# Altium schematic sheet 继电器版本.SchDoc
size A4
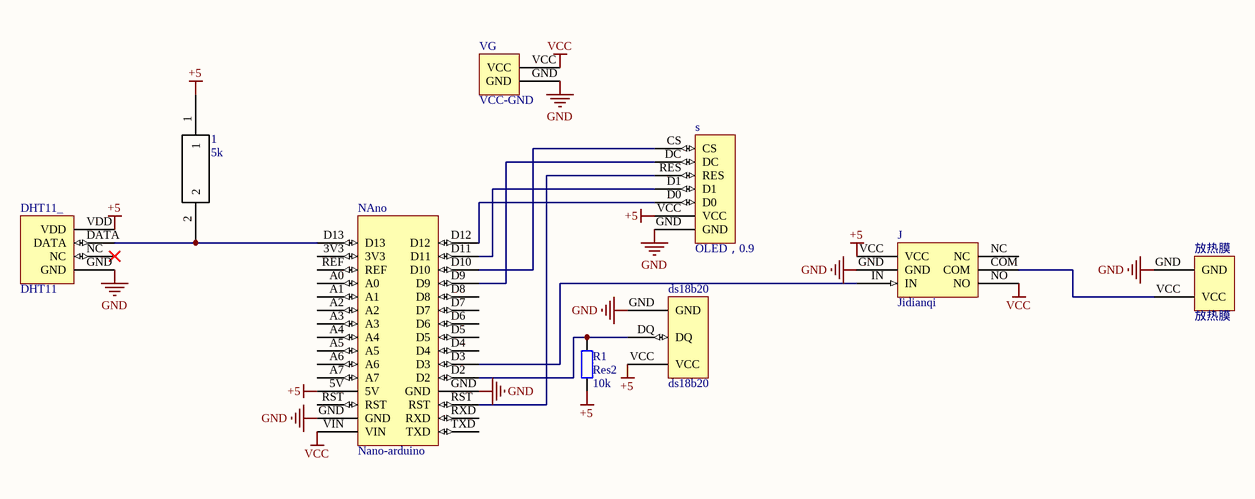
[diagram p0: 继电器版本.SchDoc]

## Parts
1  5k  [51ou]
DHT11_  DHT11  [DHT11]
ds18b20  ds18b20  [ds18b20]
J  Jidianqi  [Jidianqi]
NAno  Nano-arduino  [Nano]
R1  Res2  value 10k  [AXIAL-0.4]
s  OLED，0.9  [OLED 0.9]
VG  VCC-GND  [VCC-gnd]
放热膜  放热膜  [hit-pic]

## Nets
+5: 1.1 DHT11_.VDD ds18b20.VCC J.VCC NAno.5V R1.1 s.VCC
GND: DHT11_.GND ds18b20.GND J.GND NAno.GND s.GND VG.GND 放热膜.GND
VCC: J.NO NAno.VIN VG.VCC
Net1_2: 1.2 DHT11_.DATA NAno.D13
Netds18b20_DQ: ds18b20.DQ NAno.D2 R1.2
NetJ_COM: J.COM 放热膜.VCC
NetJ_IN: J.IN NAno.D3
NetNAno_D9: NAno.D9 s.DC
NetNAno_D10: NAno.D10 s.CS
NetNAno_D11: NAno.D11 s.D1
NetNAno_D12: NAno.D12 s.D0
NetNAno_RST: NAno.RST s.RES

Not connected (* = marked no-connect by the designer): DHT11_ NC*; J NC; NAno 3V3 A0 A1 A2 A3 A4 A5 A6 A7 D4 D5 D6 D7 D8 REF RXD TXD

## Library data of the parts
1 = 51ou
R1 = Res2: Resistor; Published: 8-Jun-2000; LatestRevisionDate: 17-Jul-2002; LatestRevisionNote: Re-released for DXP Platform.; PackageReference: AXIAL-0.4; Publisher: Altium Limited; PackageDescription: Axial Device, Thru-Hole; 2 Leads; 0.4 in Pin Spacing